# EAGLE schematic h-bridge (EAGLE 9.6.2)
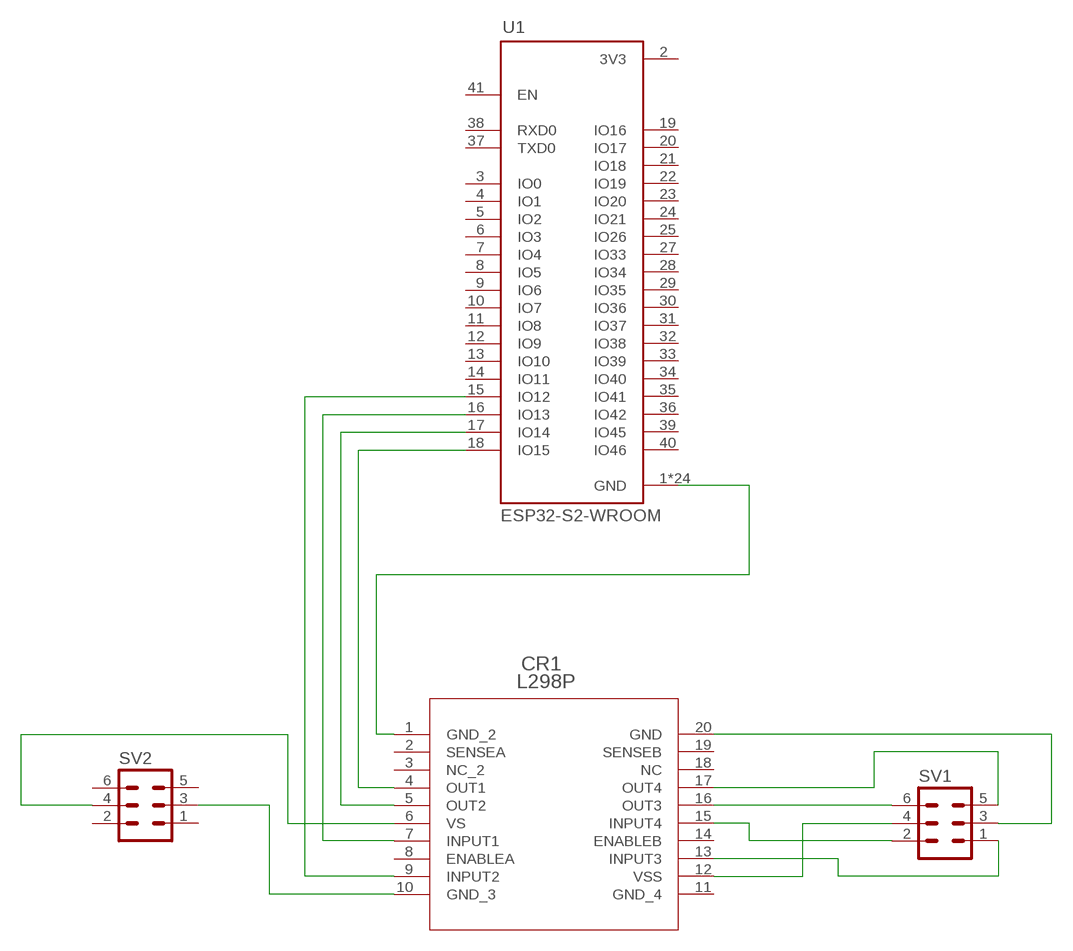
[diagram p0: schematic, sheet 1]

## Parts
CR1  L298P  [POWERSO-20_STM]
SV1  ML6  [ML6]
SV2  ML6  [ML6]
U1  ESP32-S2-WROOM  [XCVR_ESP32-S2-WROOM]

## Nets
N$1: CR1.1(GND_2) U1.1(GND) U1.26(GND) U1.42(GND) U1.43.1(GND) U1.43.2(GND) U1.43.3(GND) U1.43.4(GND) U1.43.5(GND) U1.43.6(GND) U1.43.7(GND) U1.43.8(GND) U1.43.9(GND) U1.43.10(GND) U1.43.11(GND) U1.43.12(GND) U1.43.13(GND) U1.43.14(GND) U1.43.15(GND) U1.43.16(GND) U1.43.17(GND) U1.43.18(GND) U1.43.19(GND) U1.43.20(GND) U1.43.21(GND)
N$2: CR1.4(OUT1) U1.18(IO15)
N$3: CR1.5(OUT2) U1.17(IO14)
N$4: CR1.7(INPUT1) U1.16(IO13)
N$5: CR1.9(INPUT2) U1.15(IO12)
N$6: CR1.20(GND) SV1.3
N$7: CR1.12(VSS) SV1.4
N$8: CR1.16(OUT3) SV1.6
N$9: CR1.17(OUT4) SV1.5
N$10: CR1.15(INPUT4) SV1.2
N$11: CR1.13(INPUT3) SV1.1
N$12: CR1.10(GND_3) SV2.3
N$13: CR1.6(VS) SV2.4
Unconnected: CR1.2(SENSEA) CR1.3(NC_2) CR1.8(ENABLEA) CR1.11(GND_4) CR1.14(ENABLEB) CR1.18(NC) CR1.19(SENSEB) SV2.1 SV2.2 SV2.5 SV2.6 U1.3(IO0) U1.4(IO1) U1.5(IO2) U1.6(IO3) U1.7(IO4) U1.8(IO5) U1.9(IO6) U1.10(IO7) U1.11(IO8) U1.12(IO9) U1.13(IO10) U1.14(IO11) U1.19(IO16) U1.20(IO17) U1.21(IO18) U1.22(IO19) U1.23(IO20) U1.24(IO21) U1.25(IO26) U1.27(IO33) U1.28(IO34) U1.29(IO35) U1.30(IO36) U1.31(IO37) U1.32(IO38) U1.33(IO39) U1.34(IO40) U1.35(IO41) U1.36(IO42) U1.37(TXD0) U1.38(RXD0) U1.39(IO45) U1.40(IO46) U1.41(EN)

## Power pins joined to a net without a drawn wire
3V3: U1.2(3V3)

## Library data of the parts
CR1 = shared:L298P; COPYRIGHT: Copyright (C) 2022 Ultra Librarian. All rights reserved.; MANUFACTURER_PART_NUMBER: L298P; MFR_NAME: STMicroelectronics
SV1 SV2 = con-harting-ml:ML6: HARTING; OC_FARNELL: unknown; OC_NEWARK: unknown
U1 = ESP32-S2-WROOM:ESP32-S2-WROOM: WiFi 802.11b/g/n Transceiver Module 2.4GHz PCB Trace Surface Mount Check availability <https://pricing.snapeda.com/parts/ESP32-S2-WROOM/Espressif%20Systems/view-part?ref=eda>; AVAILABILITY: In Stock; DESCRIPTION: WiFi 802.11b/g/n Transceiver Module 2.4GHz Antenna Not Included, I-PEX Surface Mount; MF: Espressif Systems; MP: ESP32-S2-WROOM; PACKAGE: VFQFN-56 Espressif Systems; PRICE: None; PURCHASE-URL: https://pricing.snapeda.com/search/part/ESP32-S2-WROOM/?ref=eda